# EasyEDA Pro project 毕业设计.eprj, schematic Schematic2

## Sheets
1 MCU+电源: Create Date: 2024-03-29; Page Name: MCU+电源; Project Name: 毕业设计; Schematic Name: Schematic2; Update Date: 2024-05-31; Company: 嘉立创EDA; Drawed: 薛金龙; Page Size: A4; Version: V1.0.1
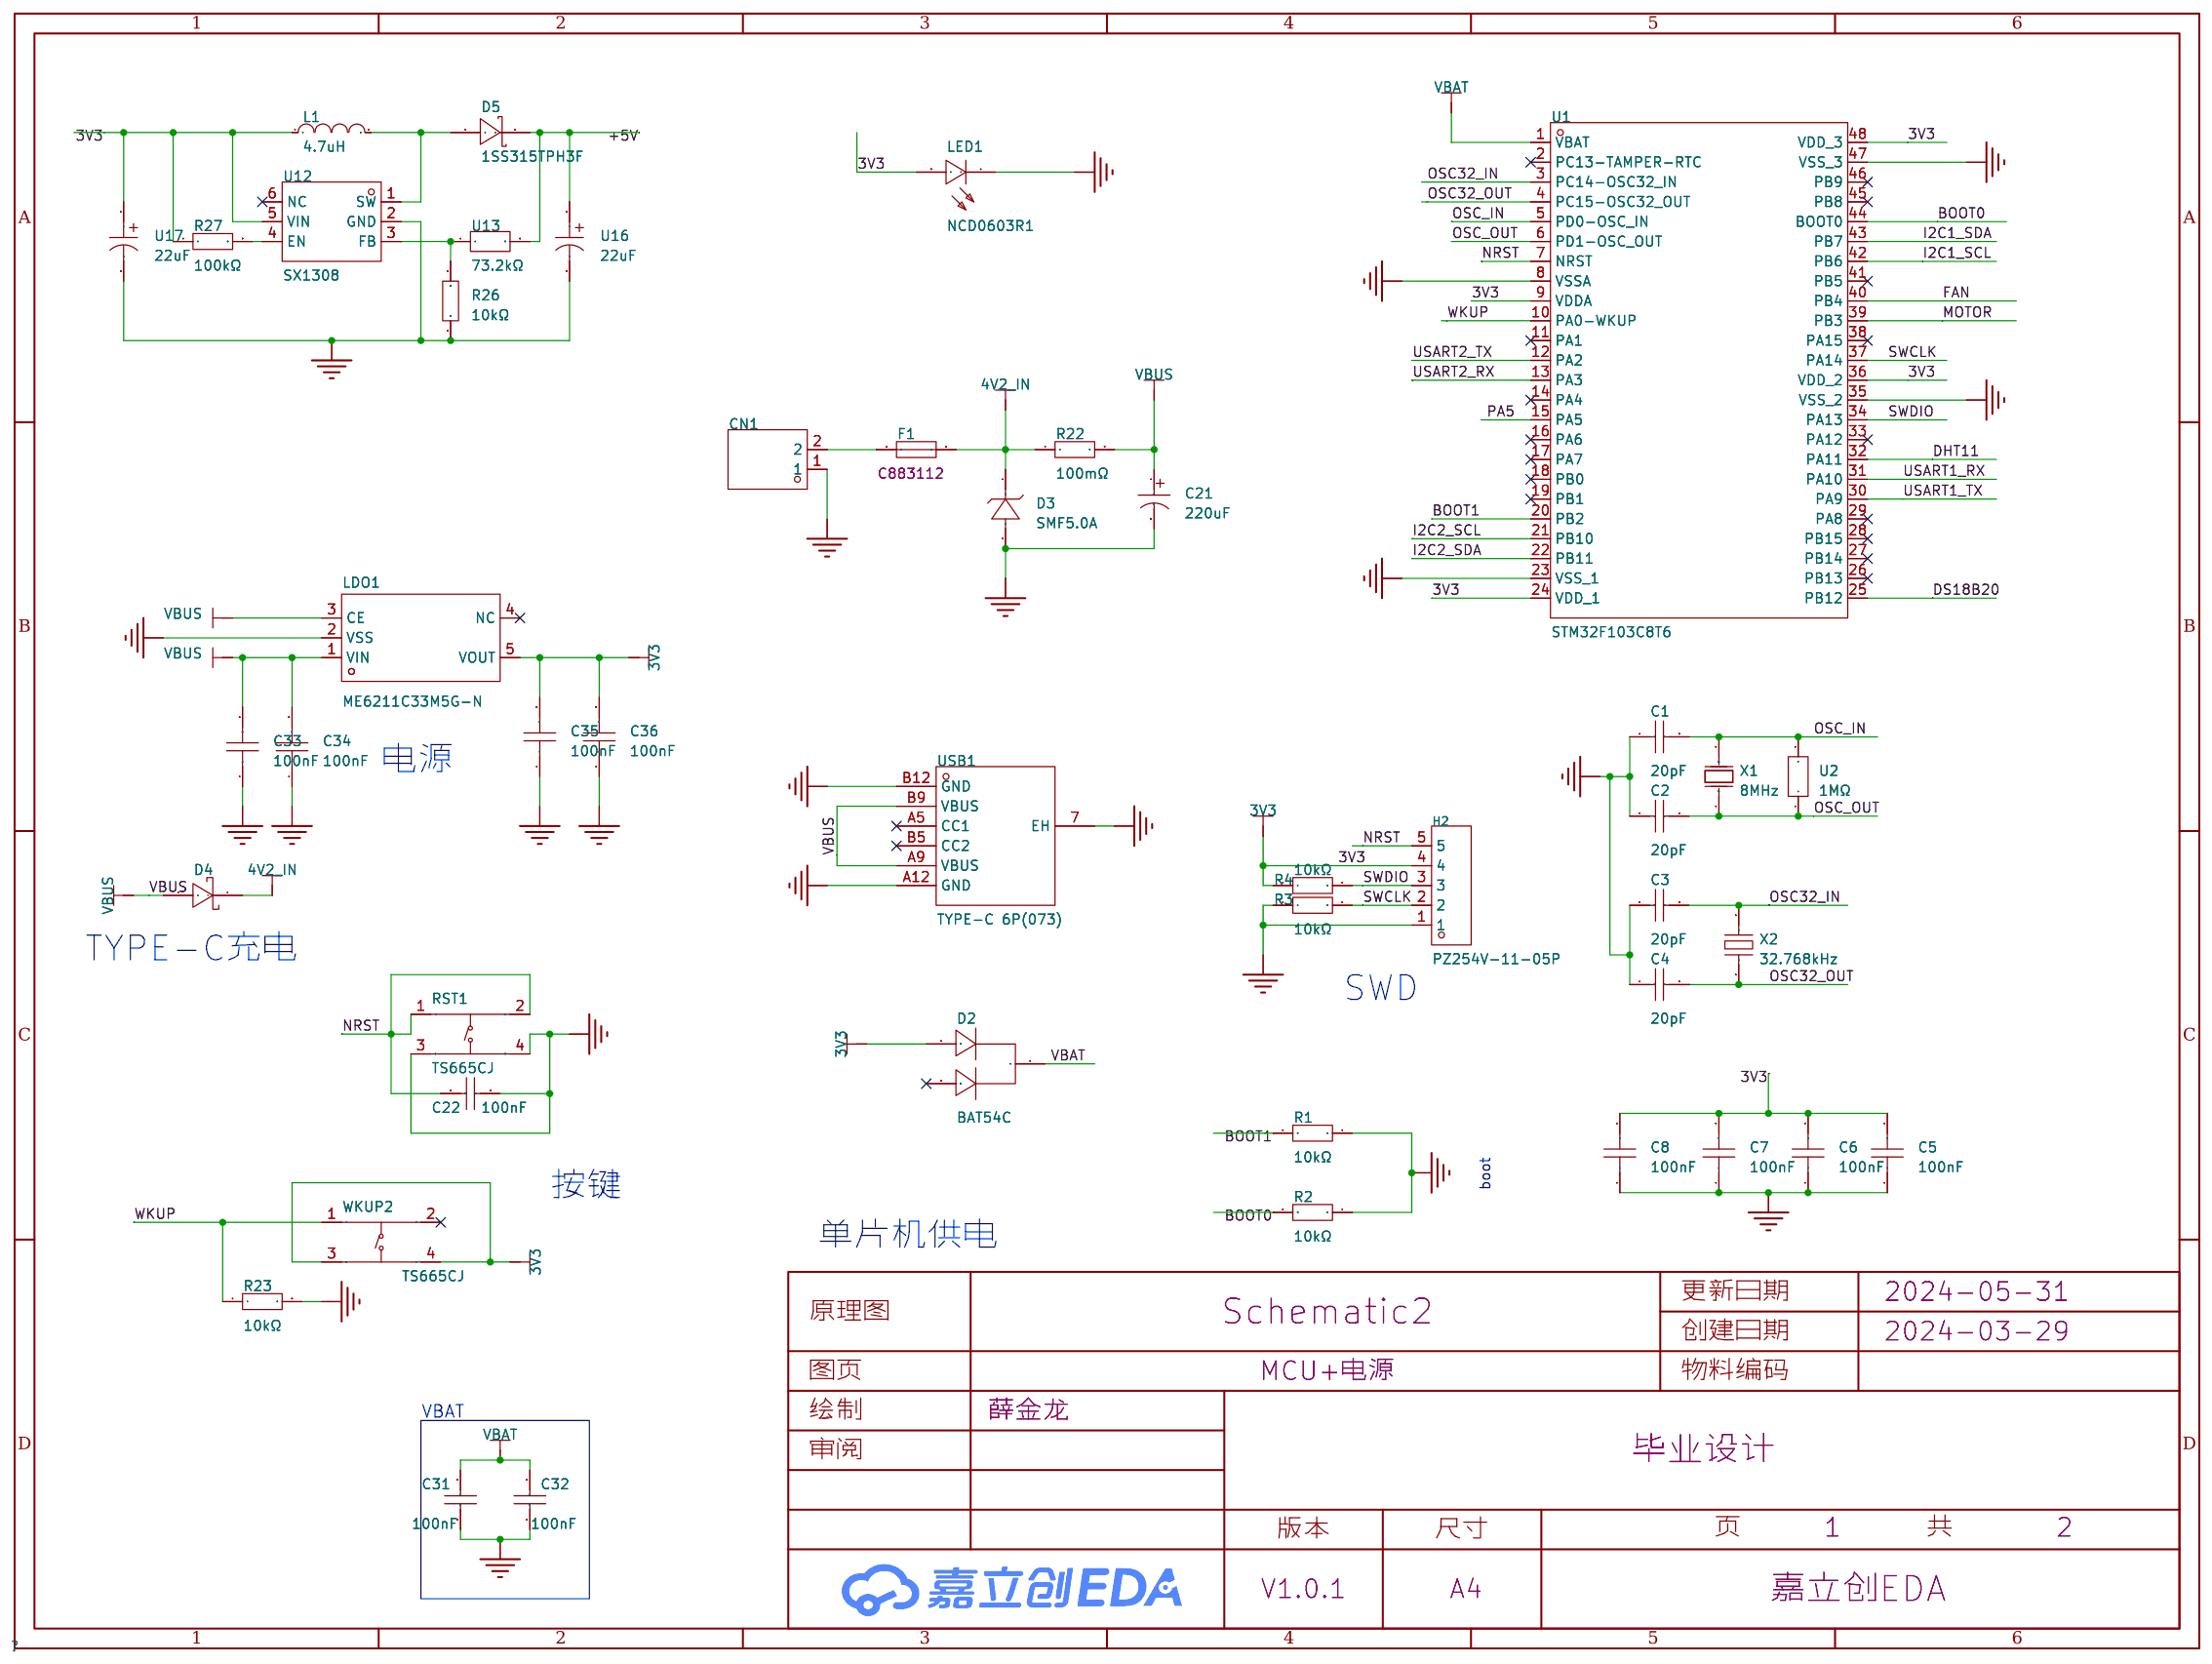
[diagram p1: MCU+电源]
2 模块: Create Date: 2024-04-08; Page Name: 模块; Version: V1.0
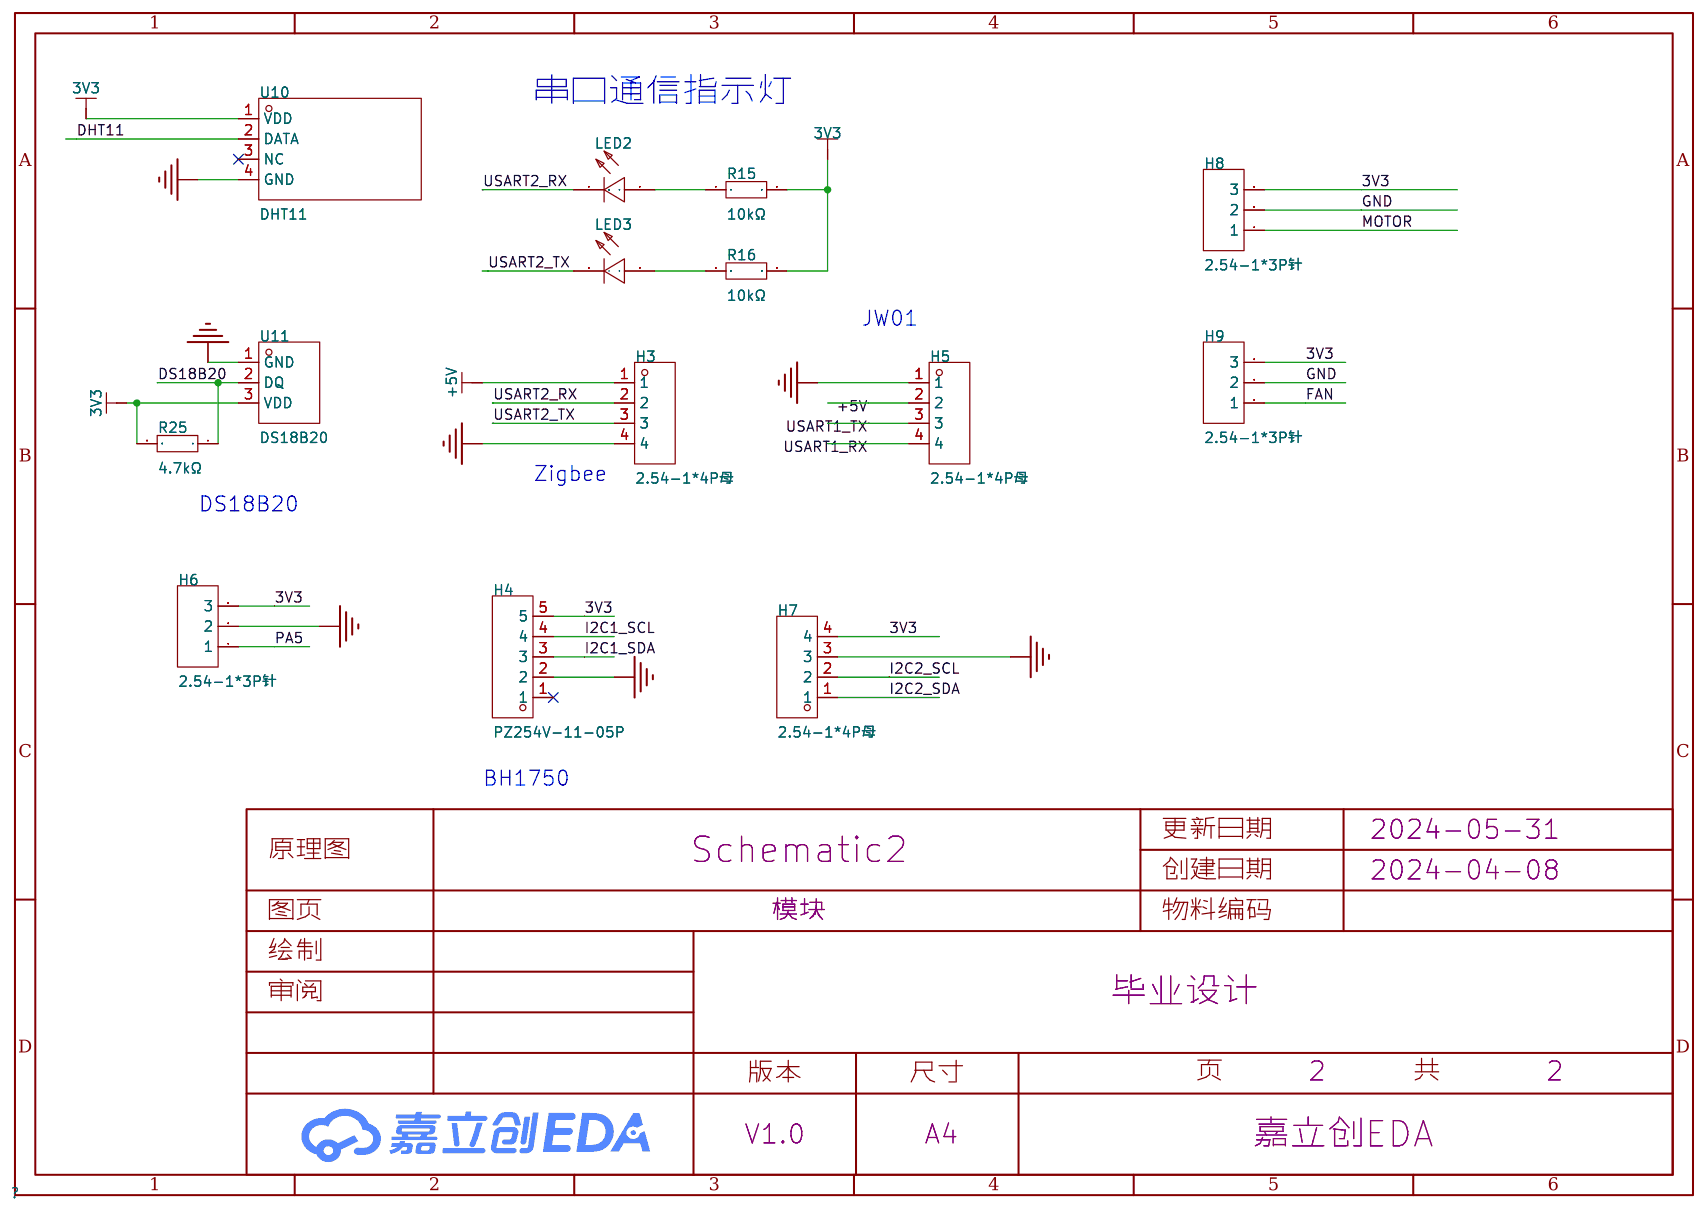
[diagram p2: 模块]

## Parts
sheet MCU+电源
C1  20pF  [C0603]
C2  20pF  [C0603]
C3  20pF  [C0603]
C4  20pF  [C0603]
C5  100nF  [C0603]
C6  100nF  [C0603]
C7  100nF  [C0603]
C8  100nF  [C0603]
C21  220uF  [CAP-TH_BD6.3-P2.50-D1.0-FD]
C22  100nF  [C0402]
C31  100nF  [C0603]
C32  100nF  [C0603]
C33  100nF  [C0603]
C34  100nF  [C0603]
C35  100nF  [C0603]
C36  100nF  [C0603]
CN1  B2B-XH-A(LF)(SN)  [CONN-TH_B2B-XH-A-LF-SN]
D2  BAT54C  [SOT-23-3_L2.9-W1.6-P1.90-LS2.8-BR]
D3  SMF5.0A  [SOD-123FL_L2.7-W1.8-LS3.8-RD]
D4  B5819W SL  [SOD-123_L2.7-W1.6-LS3.7-RD-1]
D5  1SS315TPH3F  [SOD-323_L1.8-W1.3-LS2.5-RD]
F1  BSMD0805-100-6V  [F0805]
H2  PZ254V-11-05P  [HDR-TH_5P-P2.54-V-M]
L1  4.7uH  [IND-SMD_L4.4-W4.2]
LDO1  ME6211C33M5G-N  [SOT-23-5_L3.0-W1.7-P0.95-LS2.8-BL]
LED1  NCD0603R1  [LED0603-RD_RED]
R1  10kΩ  [R0603]
R2  10kΩ  [R0603]
R3  10kΩ  [R0603]
R4  10kΩ  [R0603]
R22  100mΩ  [R0805]
R23  10kΩ  [R0603]
R26  10kΩ  [R0603]
R27  100kΩ  [R0402]
RST1  TS665CJ  [SW-TH_4P-L6.0-W6.0-P4.50-LS6.5]
U1  STM32F103C8T6  [LQFP-48_L7.0-W7.0-P0.50-LS9.0-BL]
U2  1MΩ  [R0603]
U12  SX1308  [SOT-23-6_L2.9-W1.6-P0.95-LS2.8-BL]
U13  73.2kΩ  [R0603]
U16  22uF  [CAP-TH_BD4.0-P2.00-D0.5-FD]
U17  22uF  [CAP-TH_BD4.0-P2.00-D0.5-FD]
USB1  TYPE-C 6P(073)  [TYPE-C-SMD_TYPE-C-6P]
WKUP2  TS665CJ  [SW-TH_4P-L6.0-W6.0-P4.50-LS6.5]
X1  8MHz  [CRYSTAL-SMD_L5.0-W3.2]
X2  32.768kHz  [OSC-SMD_L3.2-W1.5]
sheet 模块
H3  2.54-1*4P母  [HDR-TH_4P-P2.54-V-F]
H4  PZ254V-11-05P  [HDR-TH_5P-P2.54-V-M]
H5  2.54-1*4P母  [HDR-TH_4P-P2.54-V-F]
H6  2.54-1*3P针  [HDR-TH_3P-P2.54-V-M-1]
H7  2.54-1*4P母  [HDR-TH_4P-P2.54-V-F]
H8  2.54-1*3P针  [HDR-TH_3P-P2.54-V-M-1]
H9  2.54-1*3P针  [HDR-TH_3P-P2.54-V-M-1]
LED2  19-217/GHC-YR1S2/3T  [LED0603-RD]
LED3  NCD0603B1  [LED0603-RD]
R15  10kΩ  [R0603]
R16  10kΩ  [R0603]
R25  4.7kΩ  [R0603]
U10  DHT11  [SENSOR-TH_DHT11]
U11  DS18B20  [TO-92-3_L4.9-W3.7-P1.27-L]

## Library data of the parts
C1-C4 = CL10C200JB8NNNC: 容值:20pF;精度:±5%;额定电压:50V;材质(温度系数):C0G;; LCSC Part Name: 20pF ±5% 50V; Supplier Part: C1648; Manufacturer: SAMSUNG(三星); Supplier Footprint: 0603; JLCPCB Part Class: Basic Part; Datasheet: https://atta.szlcsc.com/upload/public/pdf/source/20160218/1457707763339.pdf; Supplier: LCSC; Tolerance: ±5%; Voltage Rated: 50V; Temperature Coefficient: C0G
C5-C8 C33-C36 = CC0603KRX7R9BB104: 容值:100nF;精度:±10%;额定电压:50V;材质(温度系数):X7R;; LCSC Part Name: 100nF ±10% 50V; Supplier Part: C14663; Manufacturer: YAGEO(国巨); Supplier Footprint: 0603; JLCPCB Part Class: Basic Part; Datasheet: https://atta.szlcsc.com/upload/public/pdf/source/20180910/C282072_33301C7F631E79921B82A8DAC6BCC5B3.pdf; Supplier: LCSC; Tolerance: ±10%; Voltage Rated: 50V; Temperature Coefficient: X7R
C21 = KM227M025E11RR0VH2FP0: 容值:220uF;精度:±20%;额定电压:25V;纹波电流:-;等效串联电阻:-;; LCSC Part Name: 220uF ±20% 25V; Supplier Part: C12450; Manufacturer: CX(承兴); Supplier Footprint: 插件,D6.3xL11mm; JLCPCB Part Class: Extended Part; Datasheet: https://atta.szlcsc.com/upload/public/pdf/source/20211027/06D6BA3719C264B639DC286D935D03EA.pdf; Supplier: LCSC; Tolerance: ±20%; Rated Voltage: 25V; φD: 6.3mm; L: 11mm; Lead Spacing: 2.5mm; Lifetime @ Temp: 1000hrs@105℃
C22 = CL05B104KO5NNNC: 容值:100nF;精度:±10%;额定电压:16V;材质(温度系数):X7R;; LCSC Part Name: 100nF ±10% 16V; Supplier Part: C1525; Manufacturer: SAMSUNG(三星); Supplier Footprint: 0402; JLCPCB Part Class: Basic Part; Datasheet: https://atta.szlcsc.com/upload/public/pdf/source/20160103/1457707674891.pdf; Supplier: LCSC; Tolerance: ±10%; Voltage Rated: 16V; Temperature Coefficient: X7R
C31 C32 = 0603B104K500NT: 容值:100nF;精度:±10%;额定电压:50V;材质(温度系数):X7R;; LCSC Part Name: 100nF ±10% 50V; Supplier Part: C30926; Manufacturer: FH(风华); Supplier Footprint: 0603; JLCPCB Part Class: Extended Part; Datasheet: https://atta.szlcsc.com/upload/public/pdf/source/20170923/C30926_1506149436298988724.pdf; Supplier: LCSC; Tolerance: ±10%; Voltage Rated: 50V; Temperature Coefficient: X7R
CN1 = B2B-XH-A(LF)(SN): 参考系列:XH;间距:2.5mm;插针结构:1x2P;排数:1;每排PIN数:2;行距:-;安装方式:-;触头材质:黄铜;; LCSC Part Name: XH 2.5mm 1x2P; Supplier Part: C158012; Manufacturer: JST; Supplier Footprint: 插件,P=2.5mm; JLCPCB Part Class: Extended Part; Datasheet: https://atta.szlcsc.com/upload/public/pdf/source/20180319/9D0AC2122F92891443E3C996983D6D0E.pdf; Supplier: LCSC; Reference Series: XH; Pitch: 2.5mm; Pins Structure: 1x2P; Number of Rows: 1; Number of PINs Per Row: 2; Contact Material: 黄铜
D2 = BAT54C_C2135: 二极管配置:-;直流反向耐压(Vr):30V;平均整流电流(Io):200mA;正向压降(Vf):1V@100mA;; LCSC Part Name: 30V 200mA 1V@100mA; Supplier Part: C2135; Manufacturer: CJ(江苏长电/长晶); Supplier Footprint: SOT-23; JLCPCB Part Class: Extended Part; Datasheet: https://atta.szlcsc.com/upload/public/pdf/source/20140809/1457707208935.pdf; Supplier: LCSC; Reverse Voltage (Vr): 30V; Average Rectified Current (Io): 200mA; Forward Voltage (Vf@If): 1V@100mA
D3 = SMF5.0A_C908213: 极性:单向;反向截止电压(Vrwm):5V;击穿电压(最小值):6.4V;击穿电压(最大值):7.25V;反向漏电流(Ir):800uA;峰值脉冲电流(Ipp)@10/1000μs:21.7A;最大钳位电压:9.2V;; LCSC Part Name: 单向 Vrwm:5V; Supplier Part: C908213; Manufacturer: FUXINSEMI(富芯森美); Supplier Footprint: SOD-123; JLCPCB Part Class: Extended Part; Datasheet: https://atta.szlcsc.com/upload/public/pdf/source/20201023/C908211_2B6F82B5D5E79B5CF282141215A9A141.pdf; Supplier: LCSC; Polarity: 单向; Reverse Stand-Off Voltage (Vrwm): 5V; Breakdown Voltage (Min): 6.4V; Breakdown Voltage (Max): 7.25V; Reverse Leakage Current (Ir): 800uA; Peak Pulse Current (Ipp)@10/1000μs: 21.7A; Maximum Clamping Voltage: 9.2V
D4 = B5819W SL: 直流反向耐压(Vr):40V;平均整流电流(Io):1A;正向压降(Vf):600mV@1A;; LCSC Part Name: 40V 1A 600mV@1A; Supplier Part: C8598; Manufacturer: CJ(江苏长电/长晶); Supplier Footprint: SOD-123; JLCPCB Part Class: Basic Part; Datasheet: https://atta.szlcsc.com/upload/public/pdf/source/20170217/1487301580783.pdf; Supplier: LCSC; Reverse Voltage (Vr): 40V; Average Rectified Current (Io): 1A; Forward Voltage (Vf@If): 600mV@1A
D5 = 1SS315TPH3F: 二极管配置:独立式;正向压降(Vf):250mV@2mA;直流反向耐压(Vr):5V;平均整流电流(Io):30mA;; LCSC Part Name: 电压:5V 电流:30mA; Supplier Part: C146374; Manufacturer: TOSHIBA(东芝); Supplier Footprint: SC-76(SOD-323); JLCPCB Part Class: 扩展库; Datasheet: https://atta.szlcsc.com/upload/public/pdf/source/20171211/C146374_15129763897731175405.pdf; Supplier: LCSC; Diode Configuration: 独立式; Forward Voltage (Vf@If): 250mV@2mA; Reverse Voltage (Vr): 5V; Average Rectified Current (Io): 30mA
F1 = BSMD0805-100-6V: 最大电压:6V;最大电流:40A;保持电流:1A;跳闸电流:2A;; LCSC Part Name: 6V 1A 0805自恢复 300毫秒内动作; Supplier Part: C883112; Manufacturer: BHFUSE(佰宏); Supplier Footprint: 0805; JLCPCB Part Class: Extended Part; Datasheet: https://atta.szlcsc.com/upload/public/pdf/source/20220223/3FD8E8A8A3681642EAEF465E16495357.pdf; Supplier: LCSC; Operating Voltage (Max): 6V; Current Rating (Max): 40A; Hold Current: 1A; Trip Current: 2A; Power Dissipation: 500mW; Resistance - Initial (Ri) (Min): 40mΩ; Resistance - Post Trip (R1) (Max): 270mΩ; Maximum Time to Trip: 300ms; Operating Temperature: -40℃~+85℃
H2 H4 = PZ254V-11-05P: 排数:单排;总PIN位数:5P;间距:2.54mm;插针结构:1x5P;行距:-;安装类型:直插;圆针/方针:方针;额定电流:-;额定电压:-;配合针长度:6mm;塑高:2.5mm;端接针长度:3mm;触头材质:黄铜;触头镀层:-;工作温度范围:-40℃~+105℃;颜色:黑色;; LCSC Part Name: 2.54mm 1x5P 直插 方针; Supplier Part: C492404; Manufacturer: XFCN(兴飞); Supplier Footprint: 插件,P=2.54mm; JLCPCB Part Class: Extended Part; Datasheet: https://atta.szlcsc.com/upload/public/pdf/source/20200309/C492404_E51533260F8710EFF5D4617281164C1D.pdf; Supplier: LCSC; Number of Rows: 单排; Number of Pins: 5P; Pitch: 2.54mm; Pin Structure: 1x5P; Mounting Type: 直插; Circluar Pins/Square Pins: 方针; Length of Mating Pin: 6mm; Insulation Height: 2.5mm; Length of End Connection Pin: 3mm; Contact Material: 黄铜; Operating Temperature Range: -40℃~+105℃; Color: 黑色
L1 = FXL0420-4R7-M: 电感值:4.7uH;精度:±20%;额定电流:2.8A;饱和电流(Isat):3A;类型:一体成型电感;; LCSC Part Name: 4.7uH ±20% 3A; Supplier Part: C167208; Manufacturer: cjiang(长江微电); Supplier Footprint: SMD,4.2x4.4mm; JLCPCB Part Class: Extended Part; Datasheet: https://atta.szlcsc.com/upload/public/pdf/source/20230516/FBADA9890E7FBE97C620F1D8B562D733.pdf; Supplier: LCSC; Tolerance: ±20%; Rated Current: 2.8A; Saturation Current (Isat): 3A; DC Resistance (DCR): 105mΩ; Type: 一体成型电感
LDO1 = ME6211C33M5G-N: 输出类型:固定;输出极性:正;最大输入电压:6V;输出电压:3.3V;输出电流:500mA;电源纹波抑制比(PSRR):70dB;; Supplier Part: C82942; Manufacturer: MICRONE(南京微盟); Supplier Footprint: SOT-23-5; JLCPCB Part Class: Extended Part; Datasheet: https://atta.szlcsc.com/upload/public/pdf/source/20170918/C82942_1505727073070976520.pdf; Supplier: LCSC; Output Type: 固定; Output Polarity: 正; Number of Outputs: 1; Maximum Input Voltage: 6V; Output Voltage: 3.3V; Dropout Voltage: 260mV@(200mA); Output Current: 500mA; Power Supply Rejection Ratio (PSRR): 70dB
LED1 = NCD0603R1_C84263: 灯头类型:-;发光颜色:红色;正向电压(VF):1.6V~2.6V;功率:65mW;正向电流:20mA;主波长:615nm~630nm;二极管配置:独立二极管;透镜颜色:无色透明透镜;色温:-;发光强度:80mcd~220mcd;发光角度:130°;载带方式:-;工作温度:-30℃~+85℃;; Supplier Part: C84263; Manufacturer: 国星光电; Supplier Footprint: 0603; JLCPCB Part Class: 扩展库; Datasheet: https://atta.szlcsc.com/upload/public/pdf/source/20200820/C84263_DABC6A75E58F576973B407FDBA283D60.pdf; Supplier: LCSC; Emitted Color: 红色; Forward Voltage (VF): 1.6V~2.6V; Power Dissipation: 65mW; Forward Current: 20mA; Dominant Wavelength: 615nm~630nm; Diode Configuration: 独立二极管; Lens Color: 无色透明透镜; Luminous Intensity: 80mcd~220mcd; Viewing Angle: 130°; Operating Temperature: -30℃~+85℃
R1 R2 R26 = 0603WAF1002T5E: 电阻类型:厚膜电阻;阻值:10kΩ;精度:±1%;功率:100mW;最大工作电压:75V;温度系数:±100ppm/℃;; LCSC Part Name: 厚膜电阻 10kΩ ±1% 100mW; Supplier Part: C25804; Manufacturer: UNI-ROYAL(厚声); Supplier Footprint: 0603; JLCPCB Part Class: Basic Part; Datasheet: https://atta.szlcsc.com/upload/public/pdf/source/20200306/C422600_1E6D84923E4A46A82E41ADD87F860B5C.pdf; Supplier: LCSC; Type: 厚膜电阻; Tolerance: ±1%; Power(Watts): 100mW; Overload Voltage (Max): 75V; Temperature Coefficient: ±100ppm/℃; Operating Temperature Range: -55℃~+155℃
R3 R4 R15 R16 R23 = 0603WAF1002T5E: 电阻类型:厚膜电阻;阻值:10kΩ;精度:±1%;功率:100mW;; LCSC Part Name: 厚膜电阻 10kΩ ±1% 100mW; Supplier Part: C25804; Manufacturer: UNI-ROYAL(厚声); Supplier Footprint: 0603; JLCPCB Part Class: Basic Part; Datasheet: https://atta.szlcsc.com/upload/public/pdf/source/20200306/C422600_1E6D84923E4A46A82E41ADD87F860B5C.pdf; Supplier: LCSC; Type: 厚膜电阻; Tolerance: ±1%; Power(Watts): 100mW; Overload Voltage (Max): 75V; Temperature Coefficient: ±100ppm/℃; Operating Temperature Range: -55℃~+155℃
R22 = 0805W8F100LT5E: 阻值:100mΩ;精度:±1%;功率:125mW;; LCSC Part Name: 100mΩ ±1% 125mW; Supplier Part: C127687; Manufacturer: UNI-ROYAL(厚声); Supplier Footprint: 0805; JLCPCB Part Class: Extended Part; Datasheet: https://atta.szlcsc.com/upload/public/pdf/source/20170821/C127687_1503303433318901668.pdf; Supplier: LCSC; Tolerance: ±1%; Power(Watts): 125mW; Temperature Coefficient: ±800ppm/℃
R27 = RC0402FR-07100KL: 电阻类型:厚膜电阻;阻值:100kΩ;精度:±1%;功率:62.5mW;最大工作电压:50V;温度系数:±100ppm/℃;; LCSC Part Name: 厚膜电阻 100kΩ ±1% 62.5mW; Supplier Part: C60491; Manufacturer: YAGEO(国巨); Supplier Footprint: 0402; JLCPCB Part Class: 扩展库; Datasheet: https://atta.szlcsc.com/upload/public/pdf/source/20180927/C295883_E8D83085EA81BD7DE0B2B681138C15EE.pdf; Supplier: LCSC; Type: 厚膜电阻; Tolerance: ±1%; Power(Watts): 62.5mW; Overload Voltage (Max): 50V; Temperature Coefficient: ±100ppm/℃; Operating Temperature Range: -55℃~+155℃
RST1 WKUP2 = TS665CJ: 电路结构:单刀单掷;按钮形状:圆形按钮;安装方式:直插;开关长度:6mm;开关宽度:6mm;开关高度:5mm;触点电流:50mA;额定电压(DC):12V;带灯:-;机械寿命:-;; LCSC Part Name: 6*6*5mm 直插 轻触开关; Supplier Part: C393938; Manufacturer: SHOU HAN(首韩); Supplier Footprint: 插件; JLCPCB Part Class: 扩展库; Datasheet: https://atta.szlcsc.com/upload/public/pdf/source/20190521/C393938_BDABEAC600B4C55E200A80AA129B70BC.pdf; Supplier: LCSC; Circuit: 单刀单掷; Actuator Style: 圆形按钮; Mounting Style: 直插; Switch Length: 6mm; Switch Width: 6mm; Switch Height: 5mm; Contact Current: 50mA; Voltage Rating (DC): 12V
U1 = STM32F103C8T6: CPU内核:CM3;程序存储容量:64KB;RAM总容量:20KB;GPIO端口数量:37;工作电压范围:2V~3.6V;CPU最大主频:72MHz;程序存储器类型:FLASH;; LCSC Part Name: STM32F103C8T6 MSL=3; Supplier Part: C8734; Manufacturer: ST(意法半导体); Supplier Footprint: LQFP-48(7x7); JLCPCB Part Class: 扩展库; Datasheet: https://atta.szlcsc.com/upload/public/pdf/source/20220812/8363ACEC51AD55ECEB84799464F7CB85.pdf; Supplier: LCSC; CPU Core: CM3; Program Storage Size: 64KB; RAM Size: 20KB; GPIO Ports Number: 37; Operating Voltage Range: 2V~3.6V; CPU Maximum Speed: 72MHz; Program Memory Type: FLASH; Operating Temperature Range: -40℃~+85℃; ADC (Bit): 12bit; Universal Serial Bus: 有; Peripheral/Function: 看门狗；DMA；看门狗；片载温度传感器; Watchdog: 有; Infrared Data Association: 有; Low-Voltage Detect: 有; Direct Memory Access: 有; Internal Oscillator: 有
U2 = SC0603F1004F2BNRH: 阻值:1MΩ;精度:±1%;功率:-;温度系数:±100ppm/℃;; LCSC Part Name: 1MΩ ±1%; Supplier Part: C3152128; Manufacturer: Sunway(信维通信); Supplier Footprint: 0603; JLCPCB Part Class: Extended Part; Datasheet: https://atta.szlcsc.com/upload/public/pdf/source/20220728/FFCE43BB6DF8FA16AEE331F0F4B289DE.pdf; Supplier: LCSC; Tolerance: ±1%; Temperature Coefficient: ±100ppm/℃
U12 = SX1308: 功能类型:升压型;输入电压:2V~24V;输出电压:28V;输出电流(最大值):-;; Supplier Part: C78162; Manufacturer: SX(硕芯科技); Supplier Footprint: SOT-23-6; JLCPCB Part Class: 扩展库; Datasheet: https://atta.szlcsc.com/upload/public/pdf/source/20160920/1474356679185.pdf; Supplier: LCSC; Function: 升压型; Input Voltage: 2V~24V; Output Voltage: 28V; Switching Frequency: 1.2MHz; Synchronous Rectification: 否; Number of Outputs: 1; Topology: 升压式; Switch tube (built-in/external): 内置
U13 = FRC0603F7322TS: 电阻类型:厚膜电阻;阻值:73.2kΩ;精度:±1%;功率:100mW;最大工作电压:75V;温度系数:±100ppm/℃;; LCSC Part Name: 73.2kΩ ±1% 100mW 厚膜电阻; Supplier Part: C2933257; Manufacturer: FOJAN(富捷); Supplier Footprint: 0603; JLCPCB Part Class: 扩展库; Datasheet: https://atta.szlcsc.com/upload/public/pdf/source/20211221/925EC7D7225764EE0046F22065062C87.pdf; Supplier: LCSC; Type: 厚膜电阻; Tolerance: ±1%; Power(Watts): 100mW; Overload Voltage (Max): 75V; Temperature Coefficient: ±100ppm/℃; Operating Temperature Range: -55℃~+155℃
U16 U17 = KM1E220M0407: 容值:22uF;精度:±20%;额定电压:25V;纹波电流:48mA@120kHz;等效串联电阻:-;; LCSC Part Name: 22uF ±20% 25V; Supplier Part: C2873975; Manufacturer: ROQANG(容强); Supplier Footprint: 插件,D4xL7mm; JLCPCB Part Class: 扩展库; Datasheet: https://atta.szlcsc.com/upload/public/pdf/source/20210825/43CC5C3A3C9845108B639C21E16A1224.pdf; Supplier: LCSC; Tolerance: ±20%; Rated Voltage: 25V; Ripple Current: 48mA@120kHz; φD: 4mm; L: 7mm; Lifetime @ Temp: 2000hrs@105℃; Operating Temperature: -40℃~+105℃
USB1 = TYPE-C 6P(073): 连接器类型:Type-C;标准:-;公母:母;端口数量:1;触点数量:6P;安装方式:卧贴;额定电流 - 电源:5A;工作温度范围:-25℃~+85℃;; LCSC Part Name: Type-C 母 卧贴; Supplier Part: C668623; Manufacturer: SHOU HAN(首韩); Supplier Footprint: SMD; JLCPCB Part Class: 扩展库; Datasheet: https://atta.szlcsc.com/upload/public/pdf/source/20200618/C668623_A4B260DED7AC1949BAC6AE39E9F4CD80.pdf; Supplier: LCSC; Connector Type: Type-C; Gender: 母; Number of Ports: 1; Number of Contacts: 6P; Mounting Style: 卧贴; Current Rating - Power (Max): 5A; Operating Temperature Range: -25℃~+85℃
X1 = X50328MSB2GI: 晶振类型:贴片晶振;频率:8MHz;常温频差:±10ppm;外接负载电容:20pF;频率稳定度(全温):±20ppm;; LCSC Part Name: 8MHz ±10ppm 20pF YSX530GA; Supplier Part: C115962; Manufacturer: YXC(扬兴晶振); Supplier Footprint: SMD5032; JLCPCB Part Class: 基础库; Datasheet: https://atta.szlcsc.com/upload/public/pdf/source/20240329/44922B0AF7B60E58E9B66993B6077277.pdf; Supplier: LCSC; Crystal Type: 贴片晶振; Normal temperature Frequency Tolerance: ±10ppm; External load capacitor: 20pF; Frequency Stability(Full temperature range): ±20ppm; Operating Temperature: -40℃~+85℃
X2 = X321532768KGD2SI: 晶振类型:贴片晶振;频率:32.768kHz;常温频差:±20ppm;外接负载电容:12.5pF;频率稳定度(全温):-;; LCSC Part Name: 32.768kHz ±20ppm 12.5pF; Supplier Part: C620155; Manufacturer: YXC(扬兴晶振); Supplier Footprint: SMD3215-2P; JLCPCB Part Class: 扩展库; Datasheet: https://atta.szlcsc.com/upload/public/pdf/source/20240329/3A7650FD985DD0DE85694D3785AB4916.pdf; Supplier: LCSC; Crystal Type: 贴片晶振; Normal temperature Frequency Tolerance: ±20ppm; External load capacitor: 12.5pF; Operating Temperature: -40℃~+85℃
H3 H5 H7 = 2.54-1*4P母: 插孔结构:1x4P;间距:2.54mm;行距:-;圆孔/方孔:方孔;安装类型:直插;排数:单排;总孔位数:4P;额定电流:3A;额定电压:-;插孔方向:顶部;塑高:-;触头材质:青铜;触头镀层:-;工作温度范围:-40℃~+105℃;焊接温度(最大值):-;; LCSC Part Name: 间距:2.54mm 1x4P 直插; Supplier Part: C2718488; Manufacturer: BOOMELE(博穆精密); Supplier Footprint: 插件,P=2.54mm; JLCPCB Part Class: Extended Part; Datasheet: https://atta.szlcsc.com/upload/public/pdf/source/20210301/C2718488_F4427B881E42CAA8DDB0B1C12B3A522C.pdf; Supplier: LCSC; Holes Structure: 1x4P; Pitch: 2.54mm; Circular Hole / Square Hole: 方孔; Mounting Type: 直插; Number of Rows: 单排; Number of Holes: 4P; Current Rating (Max): 3A; Holes Direction: 顶部; Contact Material: 青铜; Operating Temperature Range: -40℃~+105℃
H6 H8 H9 = 2.54-1*3P针: 插针结构:1x3P;间距:2.54mm;行距:-;圆针/方针:方针;安装类型:直插;排数:单排;总PIN位数:3P;额定电流:3A;额定电压:-;配合针长度:-;塑高:-;端接针长度:-;触头材质:-;触头镀层:-;工作温度范围:-40℃~+105℃;颜色:黑色;; LCSC Part Name: 间距:2.54mm 1x3P 直插 方针; Supplier Part: C49257; Manufacturer: BOOMELE(博穆精密); Supplier Footprint: 插件,P=2.54mm; JLCPCB Part Class: Extended Part; Datasheet: https://atta.szlcsc.com/upload/public/pdf/source/20221018/3E9408392E35E6F57A28985E5F7BF5C9.pdf; Supplier: LCSC; Pin Structure: 1x3P; Pitch: 2.54mm; Circluar Pins/Square Pins: 方针; Mounting Type: 直插; Number of Rows: 单排; Number of Pins: 3P; Current Rating (Max): 3A; Operating Temperature Range: -40℃~+105℃; Color: 黑色
LED2 = 19-217/GHC-YR1S2/3T: 发光颜色:翠绿;二极管配置:-;主波长:520nm~535nm;色温:-;功率:110mW;安装方式:-;; Supplier Part: C72043; Manufacturer: EVERLIGHT(亿光); Supplier Footprint: 0603; JLCPCB Part Class: Basic Part; Datasheet: https://atta.szlcsc.com/upload/public/pdf/source/20160507/1462613613780.pdf; Supplier: LCSC; Emitted Color: 翠绿; Lens Color: 无色透明; Dominant Wavelength: 520nm~535nm; Peak Wavelength: 518nm; Forward Current: 20mA; Power Dissipation: 110mW; Viewing Angle: 120°; Operating Temperature: -40℃~+85℃
LED3 = NCD0603B1: 发光颜色:蓝灯;; LCSC Part Name: 蓝灯; Supplier Part: C84266; Manufacturer: 国星光电; Supplier Footprint: 0603; JLCPCB Part Class: Extended Part; Datasheet: https://atta.szlcsc.com/upload/public/pdf/source/20200820/C84266_6A3CDBEFA72C6CAD68EDA53474ADAE6C.pdf; Supplier: LCSC; Emitted Color: 蓝灯
R25 = 0603WAF4701T5E: 电阻类型:厚膜电阻;阻值:4.7kΩ;精度:±1%;功率:100mW;最大工作电压:75V;温度系数:±100ppm/℃;; LCSC Part Name: 4.7kΩ ±1% 100mW 厚膜电阻; Supplier Part: C23162; Manufacturer: UNI-ROYAL(厚声); Supplier Footprint: 0603; JLCPCB Part Class: 基础库; Datasheet: https://atta.szlcsc.com/upload/public/pdf/source/20200306/C422600_1E6D84923E4A46A82E41ADD87F860B5C.pdf; Supplier: LCSC; Type: 厚膜电阻; Tolerance: ±1%; Power(Watts): 100mW; Overload Voltage (Max): 75V; Temperature Coefficient: ±100ppm/℃; Operating Temperature Range: -55℃~+155℃
U10 = DHT11: 新款电容式数字温湿度传感器,老款已停产16.1x12.6x5.8mm; LCSC Part Name: DHT11  电容式传感器; Supplier Part: C117051; Manufacturer: 广州奥松; Supplier Footprint: SIP-4; JLCPCB Part Class: 扩展库; Datasheet: https://atta.szlcsc.com/upload/public/pdf/source/20170703/1499081238365.pdf; Supplier: LCSC
U11 = DS18B20_C5379069: 温度范围:-55℃~+125℃;精度:±0.4℃;接口类型:-;; Supplier Part: C5379069; Manufacturer: MSKSEMI(美森科); Supplier Footprint: TO-92; JLCPCB Part Class: Extended Part; Datasheet: https://atta.szlcsc.com/upload/public/pdf/source/20230321/E2B7C84673F98AE08C6B0E4EDF67430D.pdf; Supplier: LCSC; Temperature range: -55℃~+125℃; Resolution: ±0.4℃; Supply Voltage: 2.5V~5.5V; Standby Current: 750nA

## Nets
3V3: C5.2 C6.2 C7.2 C8.2 C35.2 C36.2 D2.1(A1) H2.4 H4.5 H6.3 H7.4 H8.3 H9.3 L1.1 LDO1.5(VOUT) LED1.2(A) R4.1 R15.2 R16.2 R25.2 R27.1 U1.9(VDDA) U1.24(VDD_1) U1.36(VDD_2) U1.48(VDD_3) U10.1(VDD) U11.3(VDD) U12.5(VIN) U17.1 WKUP2.3(C) WKUP2.4(D)
4V2_IN: D3.1(C) D4.1(-) F1.2 R22.1
+5V: D5.1(K) H3.1 H5.2 U13.2 U16.1
GND: C1.1 C2.1 C3.1 C4.1 C5.1 C6.1 C7.1 C8.1 C21.2 C22.2 C31.1 C32.1 C33.1 C34.1 C35.1 C36.1 CN1.1 D3.2(A) H2.1 H3.4 H4.2 H5.1 H6.2 H7.3 H8.2 H9.2 LDO1.2(VSS) LED1.1(K) R1.1 R2.1 R3.1 R23.2 R26.1 RST1.3(C) RST1.4(D) U1.8(VSSA) U1.23(VSS_1) U1.35(VSS_2) U1.47(VSS_3) U10.4(GND) U11.1(GND) U12.2(GND) U16.2 U17.2 USB1.7(EH) USB1.A12(GND) USB1.B12(GND)
VBAT: C31.2 C32.2 D2.3(K) U1.1(VBAT)
VBUS: C21.1 C33.2 C34.2 D4.2(+) LDO1.1(VIN) LDO1.3(CE) R22.2 USB1.A9(VBUS) USB1.B9(VBUS)
BOOT0: R2.2 U1.44(BOOT0)
BOOT1: R1.2 U1.20(PB2)
DHT11: U1.32(PA11) U10.2(DATA)
DS18B20: R25.1 U1.25(PB12) U11.2(DQ)
FAN: H9.1 U1.40(PB4)
I2C1_SCL: H4.4 U1.42(PB6)
I2C1_SDA: H4.3 U1.43(PB7)
I2C2_SCL: H7.2 U1.21(PB10)
I2C2_SDA: H7.1 U1.22(PB11)
MOTOR: H8.1 U1.39(PB3)
NRST: C22.1 H2.5 RST1.1(A) RST1.2(B) U1.7(NRST)
OSC32_IN: C3.2 U1.3(PC14-OSC32_IN) X2.2
OSC32_OUT: C4.2 U1.4(PC15-OSC32_OUT) X2.1
OSC_IN: C1.2 U1.5(PD0-OSC_IN) U2.2 X1.2(OSC2)
OSC_OUT: C2.2 U1.6(PD1-OSC_OUT) U2.1 X1.1(OSC1)
PA5: H6.1 U1.15(PA5)
SWCLK: H2.2 R3.2 U1.37(PA14)
SWDIO: H2.3 R4.2 U1.34(PA13)
USART1_RX: H5.4 U1.31(PA10)
USART1_TX: H5.3 U1.30(PA9)
USART2_RX: H3.2 LED2.1(C) U1.13(PA3)
USART2_TX: H3.3 LED3.1(-) U1.12(PA2)
WKUP: R23.1 U1.10(PA0-WKUP) WKUP2.1(A)
$1N2791: CN1.2 F1.1
$1N10003: R27.2 U12.4(EN)
$1N10023: D5.2(A) L1.2 U12.1(SW)
$1N10031: R26.2 U12.3(FB) U13.1
$2N1003: LED2.2(A) R15.1
$2N1004: LED3.2(+) R16.1

Not connected (* = marked no-connect by the designer): D2 2(A2)*; H4 1*; LDO1 4(NC)*; U1 2(PC13-TAMPER-RTC)* 11(PA1)* 14(PA4)* 16(PA6)* 17(PA7)* 18(PB0)* 19(PB1)* 26(PB13)* 27(PB14)* 28(PB15)* 29(PA8)* 33(PA12)* 38(PA15)* 41(PB5)* 45(PB8)* 46(PB9)*; U10 3(NC)*; U12 6(NC)*; USB1 A5(CC1)* B5(CC2)*; WKUP2 2(B)*

## Notes on the sheets
sheet 1
- 电源
- TYPE-C充电
- SWD
- boot
- 按键
- 单片机供电
- VBAT
sheet 2
- 串口通信指示灯
- JW01
- Zigbee
- DS18B20
- BH1750
